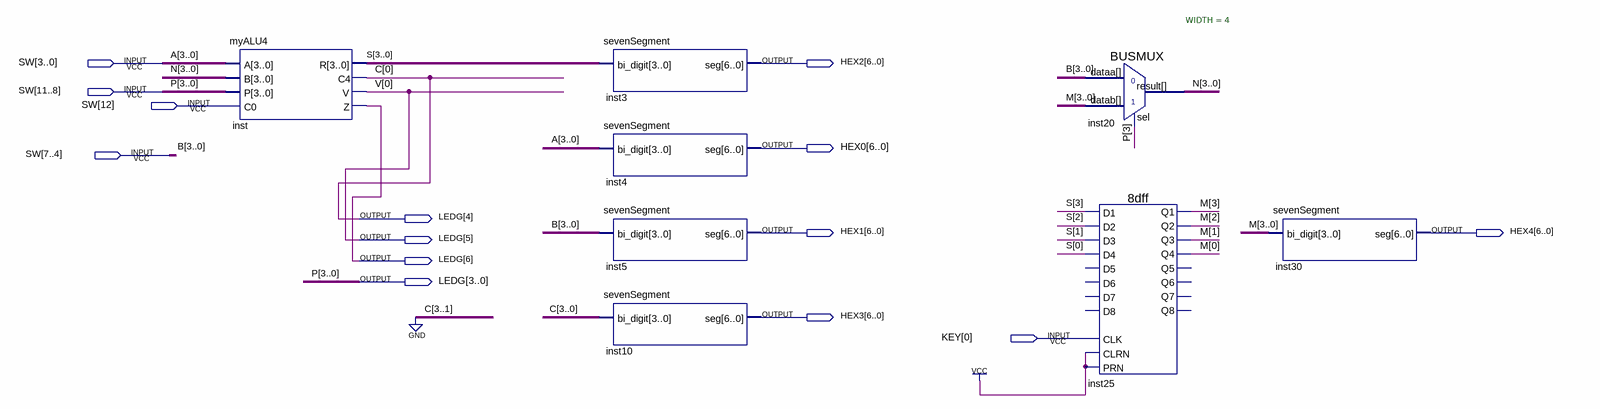
[diagram p0: schematic sheet]
// Quartus schematic Lab6.bdf as structural Verilog: 8 symbols, 14 pins
module Lab6 (
  input  [12:0] SW,
  input  [0:0] KEY,
  output [6:0] HEX2,
  output [6:0] HEX0,
  output [6:0] LEDG,
  output [6:0] HEX1,
  output [6:0] HEX4,
  output [6:0] HEX3
);

  wire [3:0] M, N, S;

  myALU4 inst (.A(SW[3:0]), .B(N), .P(SW[11:8]), .C0(SW[12]), .R(S), .C4(LEDG[4]), .V(LEDG[5]), .Z(LEDG[6]));
  sevenSegment inst3 (.bi_digit(S), .seg(HEX2));
  sevenSegment inst4 (.bi_digit(SW[3:0]), .seg(HEX0));
  sevenSegment inst5 (.bi_digit(SW[7:4]), .seg(HEX1));
  sevenSegment inst10 (.bi_digit({3'b000, LEDG[4]}), .seg(HEX3));
  BUSMUX #(.WIDTH(4)) inst20 (.datab(M), .sel(SW[11]), .dataa(SW[7:4]), .result(N));
  \8dff  inst25 (
    .D4(S[0]), .D3(S[1]), .PRN(1'b1), .CLK(KEY[0]), .CLRN(1'b1), .D2(S[2]), .D1(S[3]), .Q1(M[3]), .Q4(M[0]),
    .Q3(M[1]), .Q2(M[2]));  // open: D5, D8, D7, D6, Q8, Q5, Q6, Q7
  sevenSegment inst30 (.bi_digit(M), .seg(HEX4));

  assign LEDG[3:0] = SW[11:8];

  // Other names for the same wires on the sheet: A[3:0] = SW[3:0]; B[3:0] = SW[7:4]; C[0] = LEDG[4];
  //   P[3:0] = SW[11:8]; V[0] = LEDG[5]
endmodule
